# Altium schematic sheet MB - Copy.SchDoc
size A3
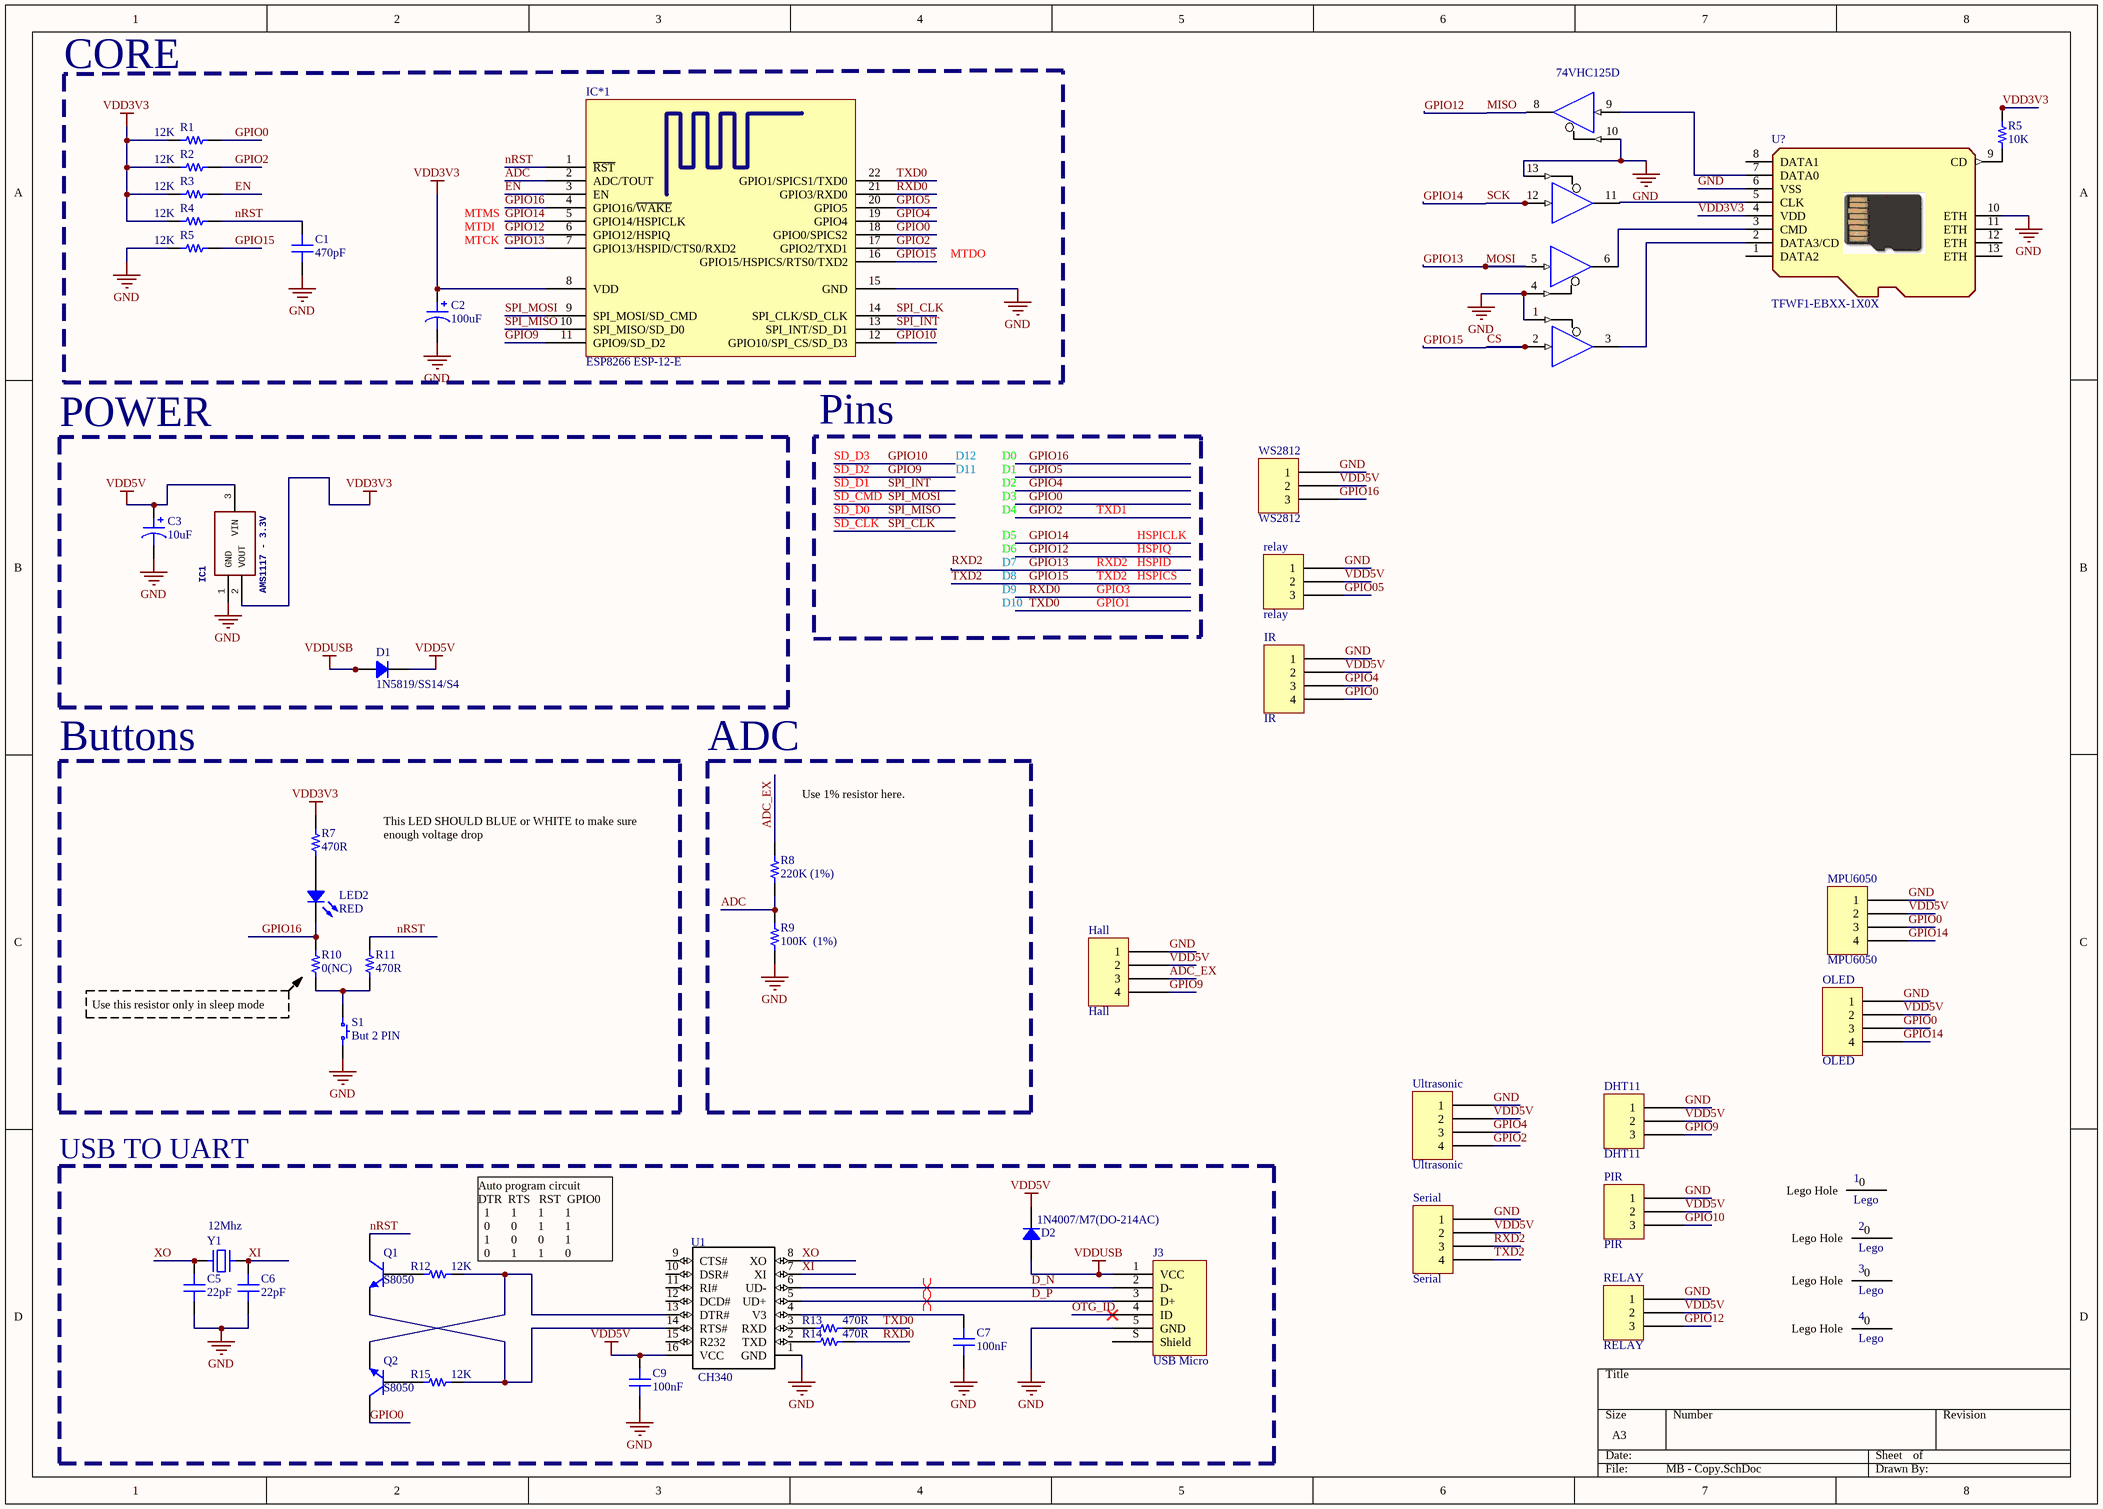
[diagram p0: MB - Copy.SchDoc]

## Parts
(Parts that share a designator on the sheet are numbered #1, #2 ... from top to bottom, then left to right.)
1  Lego  [Lego Hole]
2  Lego  [Lego Hole]
3  Lego  [Lego Hole]
4  Lego  [Lego Hole]
C1  470pF  [CAP 1206/3216]
C2  100uF  [CAP ALUM 5MM]
C3  10uF  [CAP ALUM 5MM]
C5  22pF  [CAP 1206/3216]
C6  22pF  [CAP 1206/3216]
C7  100nF  [CAP 1206/3216]
C9  100nF  [CAP 1206/3216]
D1  1N5819/SS14/S4  [DO214AC SMA]
D2  1N4007/M7(DO-214AC)  [DO214AC SMA]
DHT11  DHT11  [JST XH B3B-XH-A]
Hall  Hall  [JST XH B4B-XH-A]
IC1  AMS1117 - 3.3V  [AMS1117]
IC*1  ESP8266 ESP-12-E  [ESP8266 ESP-12-E]
IR  IR  [JST XH B4B-XH-A]
J3  USB Micro  [FCI USB 10118193-0001LF]
LED2  RED  [LED 1206/3216 BLUE]
MPU6050  MPU6050  [JST XH B4B-XH-A]
OLED  OLED  [JST XH B4B-XH-A]
PIR  PIR  [JST XH B3B-XH-A]
Q1  S8050  [SOT23]
Q2  S8050  [SOT23]
R1  12K  [RES 1206/3216]
R2  12K  [RES 1206/3216]
R3  12K  [RES 1206/3216]
R4  12K  [RES 1206/3216]
R5#1  10K  [RES 1206/3216]
R5#2  12K  [RES 1206/3216]
R7  470R  [RES 1206/3216]
R8  220K (1%)  [RES 1206/3216]
R9  100K  (1%)  [RES 1206/3216]
R10  0(NC)  [RES 1206/3216]
R11  470R  [RES 1206/3216]
R12  12K  [RES 1206/3216]
R13  470R  [RES 1206/3216]
R14  470R  [RES 1206/3216]
R15  12K  [RES 1206/3216]
relay#1  relay  [JST XH B3B-XH-A]
RELAY#2  RELAY  [JST XH B3B-XH-A]
S1  But 2 PIN  [TE FSMSMTR]
Serial  Serial  [JST XH B4B-XH-A]
U1  CH340  [SO16]
U22  MC74VHC125D  [751A-03_N]  (value not drawn)  (parts A,B,C,D of 4)
U?  TFWF1-EBXX-1X0X  [SD CARD]
Ultrasonic  Ultrasonic  [JST XH B4B-XH-A]
WS2812  WS2812  [JST XH B3B-XH-A]
Y1  12Mhz  [xtal]

## Blocks framed on the sheet
POWER: C3 D1 IC1
Buttons: LED2 R7 R10 R11 S1
ADC: R8 R9
USB TO UART: C5-C7 C9 D2 J3 Q1 Q2 R12-R15 U1 Y1

## Nets
GND: C1.1 C2.2 C3.2 C5.1 C6.1 C7.1 C9.1 DHT11.1 Hall.1 IC1.1(GND) IC*1.15(GND) IR.1 J3.5(GND) MPU6050.1 OLED.1 PIR.1 R5#2.2 R9.2 relay#1.1 RELAY#2.1 S1.2 Serial.1 U1.1(GND) U22.1(~{A}) U22.4(~{A}) U22.7(GND) U22.10(~{A}) U22.13(~{A}) U?.6(VSS) U?.10(ETH) Ultrasonic.1 WS2812.1
VDD: U22.14(VDD)
VDD3V3: C2.1 IC1.2(VOUT) IC*1.8(VDD) R1.2 R2.2 R3.2 R4.2 R5#1.1 R7.1 U?.4(VDD)
VDD5V: C3.1 C9.2 D1.2 D2.2 DHT11.2 Hall.2 IC1.3(VIN) IR.2 MPU6050.2 OLED.2 PIR.2 relay#1.2 RELAY#2.2 Serial.2 U1.16(VCC) Ultrasonic.2 WS2812.2
VDDUSB: D1.1 D2.1 J3.1(VCC)
ADC: IC*1.2(ADC/TOUT) R8.2 R9.1
ADC_EX: Hall.3 R8.1
CS: IC*1.16(GPIO15/HSPICS/RTS0/TXD2) R5#2.1 Serial.4 U22.2(B)  [also labelled GPIO15, TXD2]
D_N: J3.2(D-) U1.6(UD-)
D_P: J3.3(D+) U1.5(UD+)
EN: IC*1.3(EN) R3.1
GPIO0: IC*1.18(GPIO0/SPICS2) IR.4 MPU6050.3 OLED.3 Q2.C R1.1
GPIO2: IC*1.17(GPIO2/TXD1) R2.1 Ultrasonic.4
GPIO4: IC*1.19(GPIO4) IR.3 Ultrasonic.3
GPIO5: IC*1.20(GPIO5)
GPIO05: relay#1.3
GPIO9: DHT11.3 Hall.4 IC*1.11(GPIO9/SD_D2)
GPIO10: IC*1.12(GPIO10/SPI_CS/SD_D3) PIR.3
GPIO12: IC*1.6(GPIO12/HSPIQ) RELAY#2.3 U22.8(Y)  [also labelled MISO]
GPIO13: IC*1.7(GPIO13/HSPID/CTS0/RXD2) Serial.3 U22.5(B)  [also labelled MOSI, RXD2]
GPIO14: IC*1.5(GPIO14/HSPICLK) MPU6050.4 OLED.4 U22.12(B)  [also labelled SCK]
GPIO16: IC*1.4(GPIO16/~{WAKE}) LED2.2 R10.1 WS2812.3
nRST: C1.2 IC*1.1(~{RST}) Q1.C R4.1 R11.1
OTG_ID: J3.4(ID)
RXD0: IC*1.21(GPIO3/RXD0) R14.2
SPI_CLK: IC*1.14(SPI_CLK/SD_CLK)
SPI_INT: IC*1.13(SPI_INT/SD_D1)
SPI_MISO: IC*1.10(SPI_MISO/SD_D0)
SPI_MOSI: IC*1.9(SPI_MOSI/SD_CMD)
TXD0: IC*1.22(GPIO1/SPICS1/TXD0) R13.2
XI: C6.2 U1.7(XI) Y1.2
XO: C5.2 U1.8(XO) Y1.1
NetC7_2: C7.2 U1.4(V3)
NetLED2_1: LED2.1 R7.2
NetQ1_B: Q1.B R12.1
NetQ1_E: Q1.E R15.2 U1.14(RTS#)
NetQ2_B: Q2.B R15.1
NetQ2_E: Q2.E R12.2 U1.13(DTR#)
NetR5#1_2: R5#1.2 U?.9(CD)
NetR10_2: R10.2 R11.2 S1.1
NetR13_1: R13.1 U1.3(RXD)
NetR14_1: R14.1 U1.2(TXD)
NetU22_3: U22.3(Y) U?.2(DATA3/CD)
NetU22_6: U22.6(Y) U?.3(CMD)
NetU22_9: U22.9(B) U?.7(DATA0)
NetU22_11: U22.11(Y) U?.5(CLK)

Not connected (* = marked no-connect by the designer): 1 0(Lego_Hole); 2 0(Lego_Hole); 3 0(Lego_Hole); 4 0(Lego_Hole); J3 S(Shield); U1 9(CTS#) 10(DSR#) 11(RI#) 12(DCD#) 15(R232); U? 1(DATA2) 8(DATA1) 11(ETH) 12(ETH) 13(ETH)

## Layout directives
differential pair: D_N, D_P

## Notes on the sheet
- CORE
- MTCK
- MTDI
- MTMS
- MTDO
- (near IC*1) Pins
- SD_D0
- SD_CMD
- SD_D1
- SD_D3
- SD_D2
- D12
- D11
- D0
- D1
- D2
- D3
- D4
- TXD1
- SD_CLK
- D5
- D6
- D7
- D8
- TXD2
- RXD2
- HSPICLK
- HSPIQ
- HSPID
- HSPICS
- D9
- D10
- GPIO3
- GPIO1
- This LED SHOULD BLUE or WHITE to make sure enough voltage drop
- Use 1% resistor here.
- Use this resistor only in sleep mode
- (near R12) Auto program circuit
  DTR  RTS   RST  GPIO0
  1       1       1       1
  0       0       1       1
  1       0       0       1
  0       1       1       0
- (in symbol SD CARD) Card Bottom View

## Library data of the parts
C1 C5-C7 C9 = Capacitor: SMT Capacitor; Value: 0.1uF
C2 = Polarised Capacitor: SMT Polarised Capacitor; Value: 10uF
C3 = Polarised Capacitor: SMT Polarised Capacitor; Value: 10uF
D1 D2 = Diode: Rectifier Diode
DHT11 PIR relay#1 RELAY#2 WS2812 = 3 Pin
Hall IR MPU6050 OLED Serial Ultrasonic = 4 Pin
IC1 = AMS1117: Manufacturer_Name: Advanced Monolithic Systems; GateName_1: G$1; SymbolName_1: AMS1117-3.3V; LibraryName: ams1117-3.3v; DeviceSetName: AMS1117-3.3V; Package: SOT229P700X180-4N; Supplier_Name: RS; Manufacturer_Part_Number: ams1117-3.3v; Height: 1.8mm
J3 = USB 2.0 Type B Micro
LED2 = LED: Chip LED; Value: Green
Q1 Q2 = 2N2222: NPN; E-mail: picpars@gmail.com; De: Seyed Mohsen Ghasemian; web: www.picpars.com
R1-R4 R5#1 R5#2 R7-R15 = Resistor: SMT Resistor; Value: 1K
U1 = CH340: MF: Eaton / Cutler Hammer; Package: None; MP: CH340; Price: 223.47 USD; Availability: Bad; Value: *
U22 = MC74VHC125D: Quad Bus Buffer with 3-State Control Inputs; Published: 15-Apr-2002; LatestRevisionDate: 13-Apr-2006; LatestRevisionNote: IPC-7351 Footprint Added.; DatasheetVersion: 1997; PackageReference: 751A-03; Publisher: Altium Limited; PackageDescription: 14-Pin Small Outline Integrated Circuit 1.27 mm Pitch; Code_JEDEC: MS-012-AB; Code_IPC: SOIC127P600-14; ComponentLink1Description: Manufacturer Link; ComponentLink1URL: http://www.onsemi.com/; ComponentLink2Description: Datasheet; ComponentLink2URL: http://www.onsemi.com/pub/Collateral/MC74VHC125-D.PDF
U? = SD CARD: T-Flash 8pin SMT; Manufacturer: Wellco T&C Co., Ltd.; Link to Datasheet: *; Link to Picture: *; Operating Temp: *; Rating: *; Stability Frequency: *; Storage Temp: *; Tolerance: *; ComponentLink1Description: *; ComponentLink1URL: *; Manufacture Part #: TFWF1-EBXX-1X0X; Value: TFWF1-EBXX-1X0X
Y1 = xtal: SMT Crystal